# EAGLE design ultrasonic v1 (EAGLE 7.6.0)
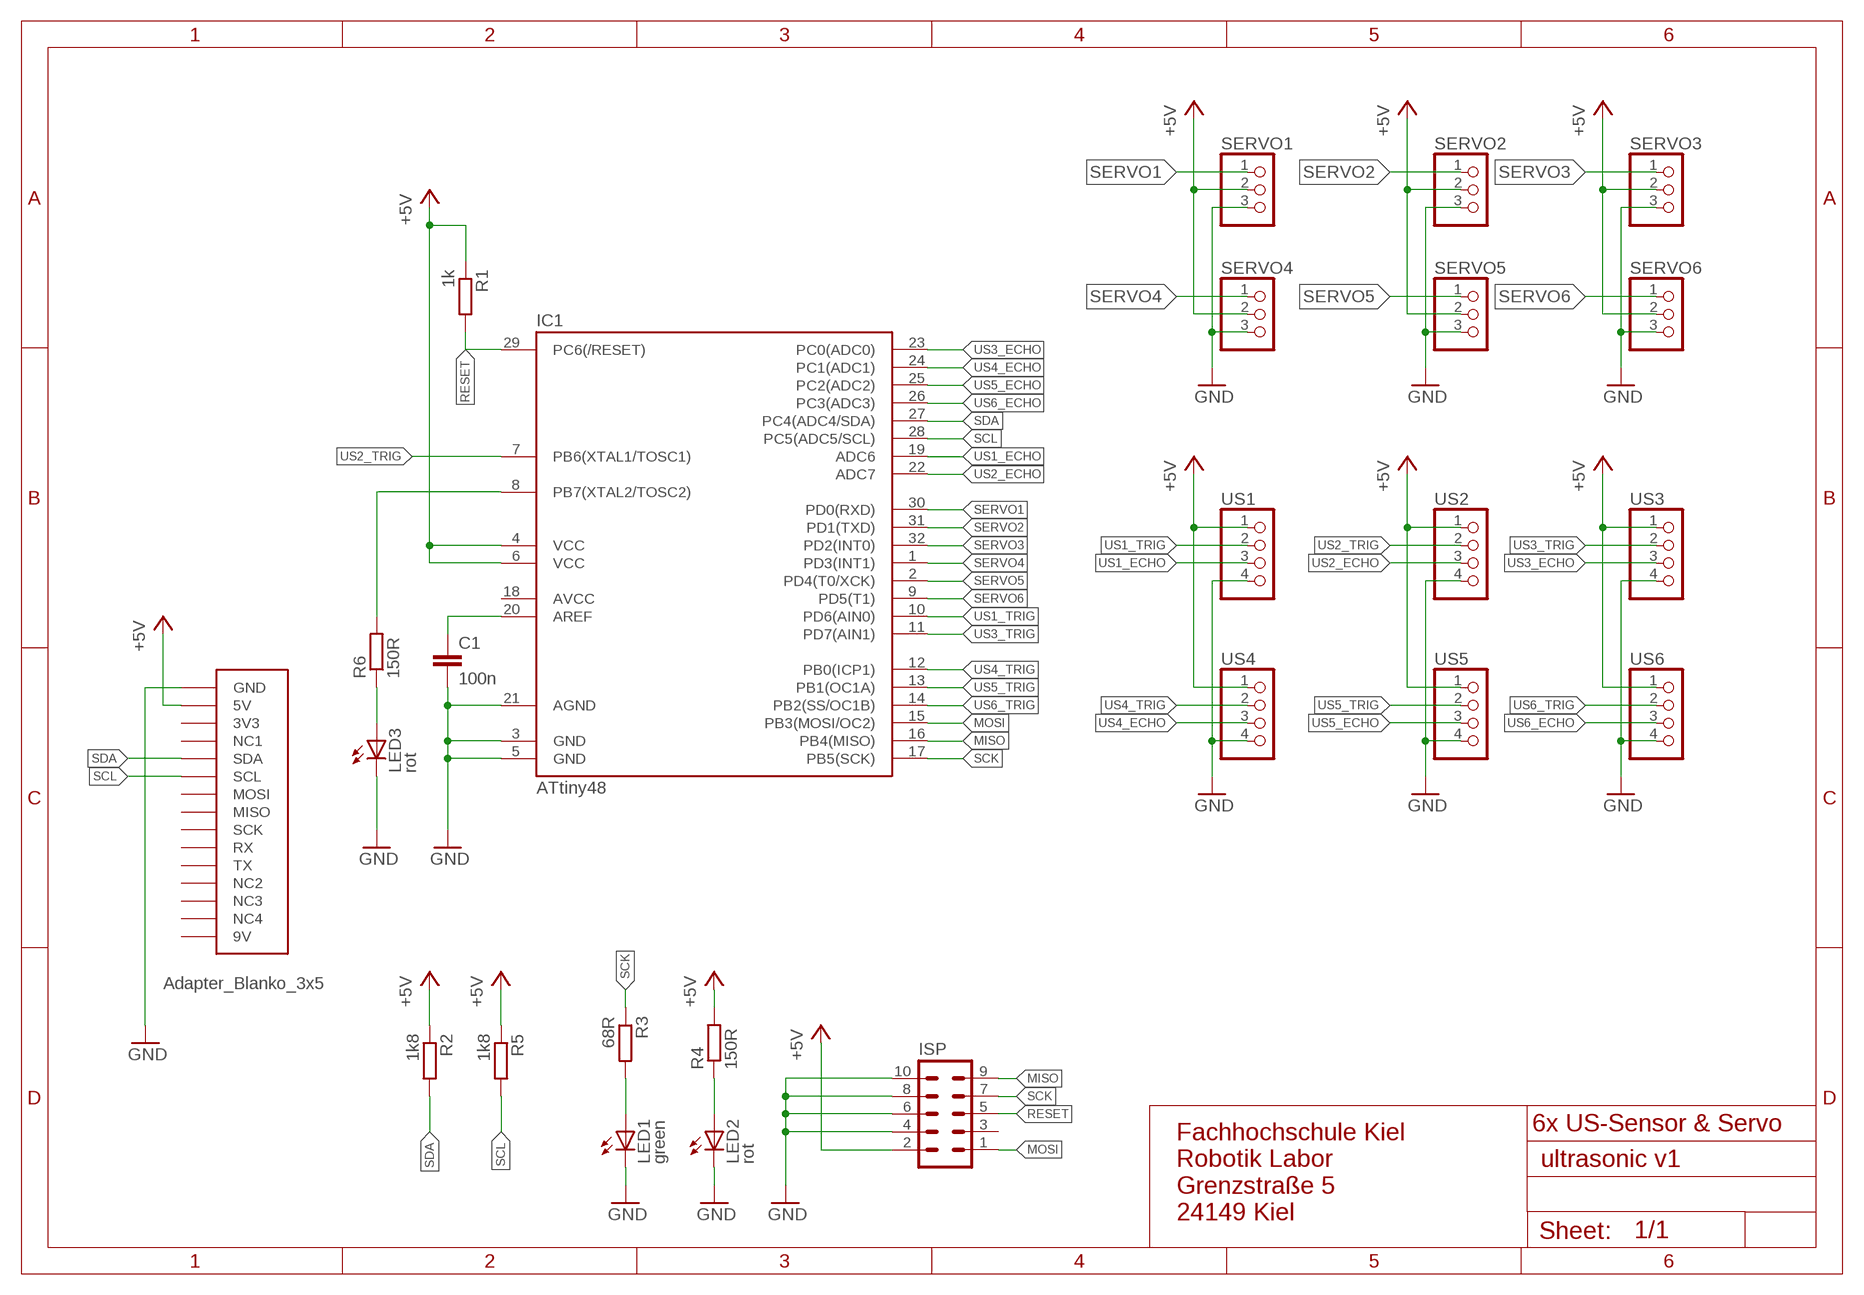
[diagram p0: schematic, sheet 1]

## Parts
C1  100n  C-EUC0805  [C0805]
IC1  ATtiny48  ATMEGA8-AU  [TQFP32-08]
ISP  ML10L  [ML10L]
LED1  green  LEDCHIP-LED0805  [CHIP-LED0805]
LED2  rot  LEDCHIP-LED0805  [CHIP-LED0805]
LED3  rot  LEDCHIP-LED0805  [CHIP-LED0805]
R1  1k  R-EU_R0805W  [R0805W]
R2  1k8  R-EU_R0805W  [R0805W]
R3  68R  R-EU_R0805W  [R0805W]
R4  150R  R-EU_R0805W  [R0805W]
R5  1k8  R-EU_R0805W  [R0805W]
R6  150R  R-EU_R0805W  [R0805W]
SERVO1  PINHD-1X3  [1X03]
SERVO2  PINHD-1X3  [1X03]
SERVO3  PINHD-1X3  [1X03]
SERVO4  PINHD-1X3  [1X03]
SERVO5  PINHD-1X3  [1X03]
SERVO6  PINHD-1X3  [1X03]
U$1  ADAPTER_BLANKO_3X5B2  [ADAPTER_BLANKO_3X5_B2]
US1  PINHD-1X4  [1X04]
US2  PINHD-1X4  [1X04]
US3  PINHD-1X4  [1X04]
US4  PINHD-1X4  [1X04]
US5  PINHD-1X4  [1X04]
US6  PINHD-1X4  [1X04]

## Nets
+5V: IC1.4(VCC) IC1.6(VCC) ISP.2 R1.1 R2.1 R4.2 R5.1 SERVO1.2 SERVO2.2 SERVO3.2 SERVO4.2 SERVO5.2 SERVO6.2 U$1.5V U$1.5V_1(5V) US1.1 US2.1 US3.1 US4.1 US5.1 US6.1
GND: C1.2 IC1.3(GND) IC1.5(GND) IC1.21(AGND) ISP.4 ISP.6 ISP.8 ISP.10 LED1.C LED2.C LED3.C SERVO1.3 SERVO2.3 SERVO3.3 SERVO4.3 SERVO5.3 SERVO6.3 U$1.GND U$1.GND1(GND) U$1.GND2(GND) U$1.GND3(GND) US1.4 US2.4 US3.4 US4.4 US5.4 US6.4
MISO: IC1.16(PB4(MISO)) ISP.9
MOSI: IC1.15(PB3(MOSI/OC2)) ISP.1
N$1: IC1.8(PB7(XTAL2/TOSC2)) R6.2
N$2: LED3.A R6.1
N$6: LED1.A R3.2
N$7: LED2.A R4.1
N$9: C1.1 IC1.20(AREF)
RESET: IC1.29(PC6(/RESET)) ISP.5 R1.2
SCK: IC1.17(PB5(SCK)) ISP.7 R3.1
SCL: IC1.28(PC5(ADC5/SCL)) R5.2 U$1.SCL U$1.SCL_1(SCL)
SDA: IC1.27(PC4(ADC4/SDA)) R2.2 U$1.SDA U$1.SDA_1(SDA)
SERVO1: IC1.30(PD0(RXD)) SERVO1.1
SERVO2: IC1.31(PD1(TXD)) SERVO2.1
SERVO3: IC1.32(PD2(INT0)) SERVO3.1
SERVO4: IC1.1(PD3(INT1)) SERVO4.1
SERVO5: IC1.2(PD4(T0/XCK)) SERVO5.1
SERVO6: IC1.9(PD5(T1)) SERVO6.1
US1_ECHO: IC1.19(ADC6) US1.3
US1_TRIG: IC1.10(PD6(AIN0)) US1.2
US2_ECHO: IC1.22(ADC7) US2.3
US2_TRIG: IC1.7(PB6(XTAL1/TOSC1)) US2.2
US3_ECHO: IC1.23(PC0(ADC0)) US3.3
US3_TRIG: IC1.11(PD7(AIN1)) US3.2
US4_ECHO: IC1.24(PC1(ADC1)) US4.3
US4_TRIG: IC1.12(PB0(ICP1)) US4.2
US5_ECHO: IC1.25(PC2(ADC2)) US5.3
US5_TRIG: IC1.13(PB1(OC1A)) US5.2
US6_ECHO: IC1.26(PC3(ADC3)) US6.3
US6_TRIG: IC1.14(PB2(SS/OC1B)) US6.2
Unconnected: IC1.18(AVCC) ISP.3 U$1.3V3 U$1.3V3_1(3V3) U$1.9V U$1.9V_1(9V) U$1.MISO U$1.MISO_1(MISO) U$1.MOSI U$1.MOSI_1(MOSI) U$1.NC1 U$1.NC2 U$1.NC3 U$1.NC4 U$1.NC5(NC1) U$1.NC6(NC2) U$1.NC7(NC3) U$1.NC8(NC4) U$1.RX U$1.RX_1(RX) U$1.SCK U$1.SCK_1(SCK) U$1.TX U$1.TX_1(TX)

## Notes on the sheet
- 6x US-Sensor & Servo
- Fachhochschule Kiel
  Robotik Labor
  Grenzstraße 5
  24149 Kiel

## Library data of the parts
C1 = rcl:C-EU: CAPACITOR, European symbol
IC1 = atmega8:ATMEGA8
ISP = con-ml:ML10L: HARTING; OC_FARNELL: unknown; OC_NEWARK: unknown
LED1-LED3 = led:LED: LED OSRAM: - CHIPLED LG R971, LG N971, LY N971, LG Q971, LY Q971, LO R971, LY R971 LH N974, LH R974 LS Q976, LO Q976, LY Q976 LO Q996 - Hyper CHIPLED LW Q18S LB Q993, LB Q99A, LB R99A - SideLED LS A670, LO A670, LY A670, LG A670, LP A670 LB A673, LV A673, LT A673, LW A673 LH A674 LY A675 LS A676, LA A676, LO A676, LY A676, LW A676 LS A679, LY A679, LG A679 - Hyper Micro SIDELED® LS Y876, LA Y876, LO Y876, LY Y876 LT Y87S - SmartLED LW L88C, LW L88S LB L89C, LB L89S, LG L890 LS L89K, LO L89K, LY L89K LS L896, LA L896, LO L896, LY L896 - TOPLED LS T670, LO T670, LY T670, LG T670, LP T670 LSG T670, LSP T670, LSY T670, LOP T670, LYG T670 LG T671, LOG T671, LSG T671 LB T673, LV T673, LT T673, LW T673 LH T674 LS T676, LA T676, LO T676, LY T676, LB T676, LH T676, LSB T676, LW T676 LB T67C, LV T67C, LT T67C, LS T67K, LO T67K, LY T67K, LW E67C LS E67B, LA E67B, LO E67B, LY E67B, LB E67C, LV E67C, LT E67C LW T67C LS T679, LY T679, LG T679 LS T770, LO T770, LY T770, LG T770, LP T770 LB T773, LV T773, LT T773, LW T773 LH T774 LS E675, LA E675, LY E675, LS T675 LS T776, LA T776, LO T776, LY T776, LB T776 LHGB T686 LT T68C, LB T68C - Hyper Mini TOPLED® LB M676 - Mini TOPLED Santana® LG M470 LS M47K, LO M47K, LY M47K Source: http://www.osram.convergy.de LUXEON: - LUMILED® LXK2-PW12-R00, LXK2-PW12-S00, LXK2-PW14-U00, LXK2-PW14-V00 LXK2-PM12-R00, LXK2-PM12-S00, LXK2-PM14-U00 LXK2-PE12-Q00, LXK2-PE12-R00, LXK2-PE12-S00, LXK2-PE14-T00, LXK2-PE14-U00 LXK2-PB12-K00, LXK2-PB12-L00, LXK2-PB12-M00, LXK2-PB14-N00, LXK2-PB14-P00, LXK2-PB14-Q00 LXK2-PR12-L00, LXK2-PR12-M00, LXK2-PR14-Q00, LXK2-PR14-R00 LXK2-PD12-Q00, LXK2-PD12-R00, LXK2-PD12-S00 LXK2-PH12-R00, LXK2-PH12-S00 LXK2-PL12-P00, LXK2-PL12-Q00, LXK2-PL12-R00 Source: www.luxeon.com KINGBRIGHT: KA-3528ASYC Source: www.kingbright.com
R1-R6 = rcl:R-EU_: RESISTOR, European symbol
SERVO1-SERVO6 = pinhead:PINHD-1X3: PIN HEADER
U$1 = Tim:ADAPTER_BLANKO_3X5: B1 = Beschriftung innen B2 = Beschriftung aussen
US1-US6 = pinhead:PINHD-1X4: PIN HEADER

## Board
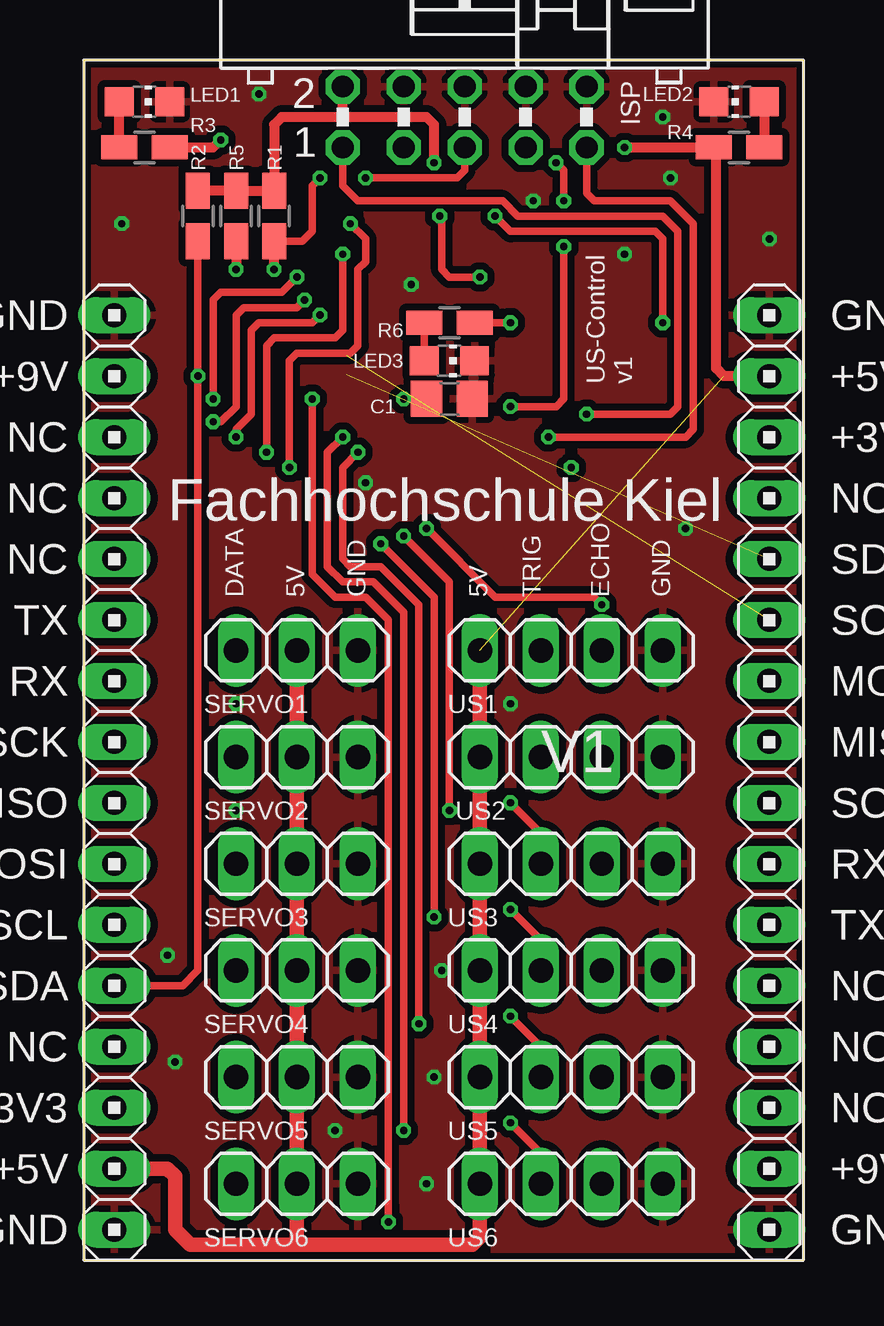
[diagram p1: board, top side]
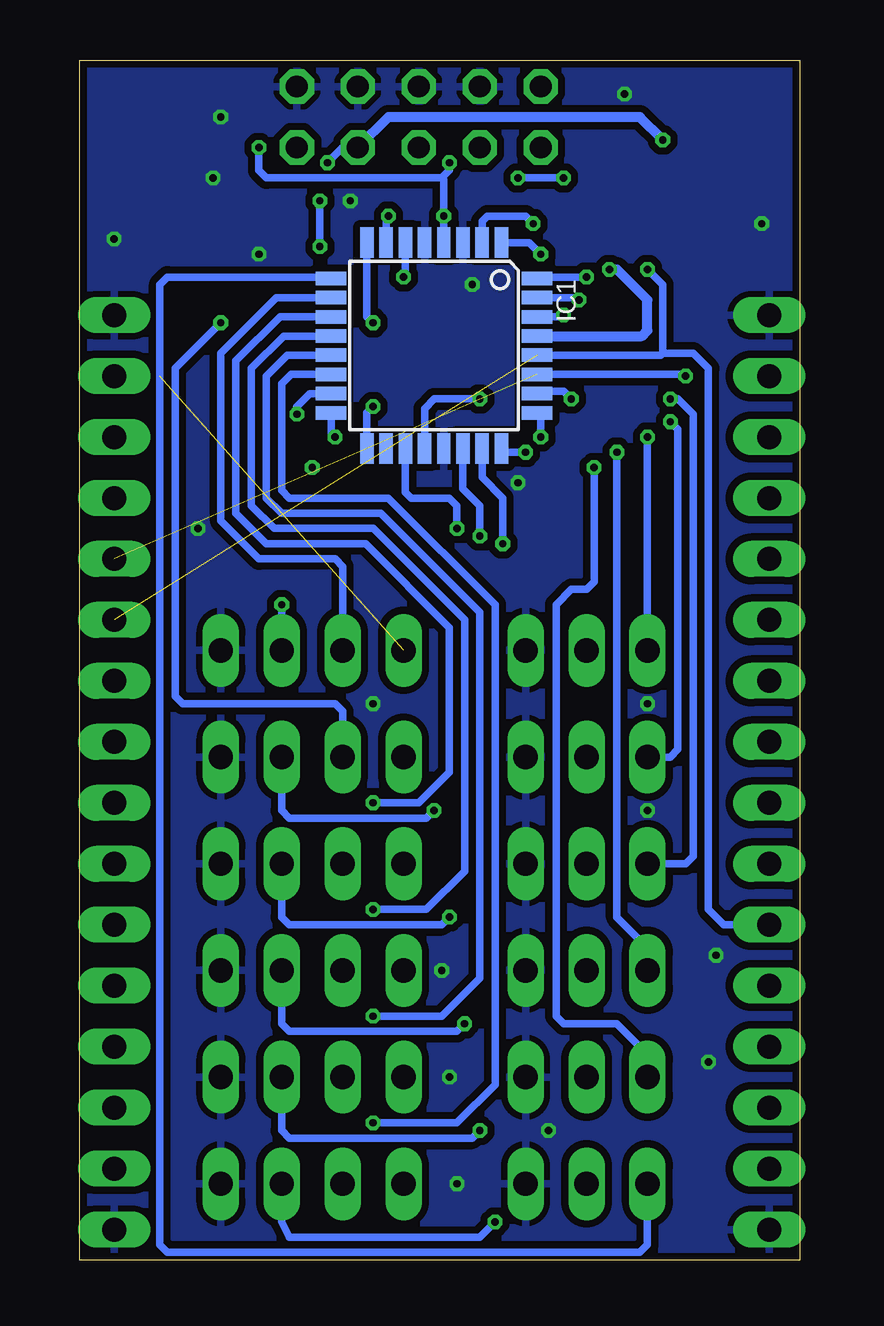
[diagram p2: board, bottom side, seen from below]

Size 30 x 50 mm. Coordinates in mm from the lower left corner, seen from the top.
Outline: 0,0 30,0 30,50 0,50 0,0
Copper layers (1*16): Top 0.035mm / dielectric 1.5mm / Bottom 0.035mm
Design rules "dirt_cheap_dirty_boards.v1": minimum track width 5mil, minimum drill 12mil, track to track 5mil, track to pad 5mil, pad to pad 5mil, via to via 5mil, smd to smd 0mil, copper to edge 10mil, drill to drill 10mil, minimum pad ring 10mil, minimum via ring 6mil, stop-mask expansion 2mil, vias tented up to drill 25mil, thermal gap 10mil

### Footprints (pad centres in the part's own frame; a part is rotated, then mirrored left to right if it is on the bottom)
C0805 = smd 1.3 x 1.5: 1 -0.95,0; 2 0.95,0
TQFP32-08 = smd 1.27 x 0.559: 1 -4.293,2.8; 2 -4.293,2; 3 -4.293,1.2; 4 -4.293,0.4; 5 -4.293,-0.4; 6 -4.293,-1.2; 7 -4.293,-2; 8 -4.293,-2.8; 17 4.293,-2.8; 18 4.293,-2; 19 4.293,-1.2; 20 4.293,-0.4; 21 4.293,0.4; 22 4.293,1.2; 23 4.293,2; 24 4.293,2.8 | smd 0.559 x 1.27: 9 -2.8,-4.293; 10 -2,-4.293; 11 -1.2,-4.293; 12 -0.4,-4.293; 13 0.4,-4.293; 14 1.2,-4.293; 15 2,-4.293; 16 2.8,-4.293; 25 2.8,4.293; 26 2,4.293; 27 1.2,4.293; 28 0.4,4.293; 29 -0.4,4.293; 30 -1.2,4.293; 31 -2,4.293; 32 -2.8,4.293
ML10L = drill 0.914 octagon: 1 -5.08,-1.27; 2 -5.08,1.27; 3 -2.54,-1.27; 4 -2.54,1.27; 5 0,-1.27; 6 0,1.27; 7 2.54,-1.27; 8 2.54,1.27; 9 5.08,-1.27; 10 5.08,1.27
CHIP-LED0805 = smd 1.2 x 1.2: A 0,-1.05; C 0,1.05
R0805W = smd 1.5 x 1: 1 -1.052,0; 2 1.052,0
1X03 = drill 1.016 long: 1 -2.54,0; 2 0,0; 3 2.54,0
ADAPTER_BLANKO_3X5_B2 = drill 1 long: 3V3 1.278,6.349; 3V3_1 28.566,34.289; 5V 1.278,3.809; 5V_1 28.566,36.829; 9V 1.278,36.829; 9V_1 28.566,3.809; GND 1.278,1.269; GND1 1.278,39.369; GND2 28.566,39.369; GND3 28.566,1.269; MISO 1.278,19.049; MISO_1 28.566,21.589; MOSI 1.278,16.509; MOSI_1 28.566,24.129; NC1 1.278,8.889; NC2 1.278,29.209; NC3 1.278,31.749; NC4 1.278,34.289; NC5 28.566,31.749; NC6 28.566,11.429; NC7 28.566,8.889; NC8 28.566,6.349; RX 1.278,24.129; RX_1 28.566,16.509; SCK 1.278,21.589; SCK_1 28.566,19.049; SCL 1.278,13.969; SCL_1 28.566,26.669; SDA 1.278,11.429; SDA_1 28.566,29.209; TX 1.278,26.669; TX_1 28.566,13.969
1X04 = drill 1.016 long: 1 -3.81,0; 2 -1.27,0; 3 1.27,0; 4 3.81,0

### Placement (x,y rotation side)
C1  15.24,35.88 0 top
IC1  15.24,38.1 270 bottom
ISP  15.88,47.62 0 top
LED1  2.54,48.26 270 top
LED2  27.3,48.26 90 top
LED3  15.24,37.47 270 top
R1  7.94,43.5 270 top
R2  4.76,43.5 270 top
R3  2.54,46.35 180 top
R4  27.3,46.35 180 top
R5  6.35,43.5 270 top
R6  15.24,39.05 0 top
SERVO1  8.89,25.4 0 top
SERVO2  8.89,20.95 0 top
SERVO3  8.89,16.51 0 top
SERVO4  8.89,12.06 0 top
SERVO5  8.89,7.62 0 top
SERVO6  8.89,3.17 0 top
U$1  0,0 0 top
US1  20.32,25.4 0 top
US2  20.32,20.95 0 top
US3  20.32,16.51 0 top
US4  20.32,12.06 0 top
US5  20.32,7.62 0 top
US6  20.32,3.17 0 top

### Tracks (layer width: path | path; a pad name or v marks a point on that pad's centre or on a via)
+5V  (via drill 0.3)  (1 unrouted)
  Top 0.305: v16.51,40.96 15.24,40.96 14.92,41.27 14.92,43.41 v14.84,43.5
  Top 0.406: v22.54,46.35 R4.2 26.35,46.26 26.35,37.15 26.67,36.83 U$1.5V_1 | R2.1 R5.1 R1.1 7.94,47.31 8.26,47.62 10.79,47.62 | v14.61,45.72 14.61,47.31 14.29,47.62 10.79,47.62 | 10.79,47.62 ISP.2 | 3.49,3.81
  Top 0.61: SERVO1.2 SERVO2.2 SERVO3.2 SERVO4.2 SERVO5.2 SERVO6.2 8.89,0.64 | US1.1 US2.1 US3.1 US4.1 US5.1 US6.1 16.51,0.95 16.19,0.64 8.89,0.64 | 3.49,3.81 3.81,3.49 3.81,1.27 4.45,0.64 8.89,0.64 | U$1.5V 3.49,3.81
  Bottom 0.305: v22.54,46.35 22.54,45.4 22.23,45.09 14.92,45.09 | v14.61,45.72 14.61,45.4 14.92,45.09 | 14.92,45.09 14.84,45 v14.84,43.5 IC1.4 | IC1.6 16.44,41.03 v16.51,40.96
GND  (via drill 0.3)
  other vias: 1.59,43.18 7.3,48.58 24.13,47.62 28.57,42.55 13.65,40.64 18.73,44.13 22.54,41.91 24.45,45.09 3.49,12.7 3.81,8.26 14.29,3.17 14.92,12.06 14.61,7.62 10.48,5.4 6.35,23.18 6.35,18.73 11.75,32.38 25.08,30.48 17.78,23.18
  pour Bottom (isolate 0.305): 0,0 0,49.85 30.16,49.85 30.16,0
  pour Top (isolate 0.305): 0,0 0,49.85 30.16,49.85 30.16,0
MISO  (via drill 0.3)
  Top 0.305: v19.37,34.29 25.08,34.29 25.4,34.61 25.4,43.18 24.45,44.13 21.27,44.13 20.95,44.45 ISP.9
  Bottom 0.305: IC1.16 19.53,34.45 v19.37,34.29
MOSI  (via drill 0.3)
  Top 0.305: ISP.1 10.79,44.77 11.43,44.13 17.46,44.13 18.1,43.5 24.13,43.5 24.77,42.86 24.77,35.56 24.45,35.24 v20.95,35.24
  Bottom 0.305: IC1.15 20.41,36.1 20.95,35.56 v20.95,35.24
N$1  (via drill 0.3)
  Top 0.305: v17.78,39.05 R6.2
  Bottom 0.305: IC1.8 18.04,39.31 v17.78,39.05
N$2
  Top 0.305: R6.1 LED3.A
N$6
  Top 0.406: R3.2 LED1.A
N$7
  Top 0.406: LED2.A R4.1
N$9  (via drill 0.3)
  Top 0.305: v13.34,35.88 C1.1
  Bottom 0.305: IC1.20 15.64,35.48 15.24,35.88 v13.34,35.88
N$11  (via drill 0.3)
  other vias: 20.32,33.02
RESET  (via drill 0.3)
  Top 0.305: ISP.5 15.88,45.4 15.56,45.09 v11.75,45.09 | v9.84,45.09 9.53,44.77 9.53,42.86 9.11,42.45 R1.2
  Top 0.406: v7.94,41.27 R1.2
  Bottom 0.305: v11.75,45.09 v9.84,45.09
  Bottom 0.406: IC1.29 6.58,38.5 6.35,38.73 6.35,40.01 7.62,41.27 v7.94,41.27
SCK  (via drill 0.3)
  Top 0.305: v20,44.13 20,45.4 v19.68,45.72 | v17.78,35.56 19.68,35.56 20,35.88 v20,42.23
  Top 0.406: R3.1 5.4,46.35 v5.71,46.67
  Bottom 0.305: v20,42.23 v20,44.13 | v19.68,45.72 19.05,46.35 ISP.7 | IC1.17 18.04,35.3 v17.78,35.56
  Bottom 0.406: ISP.7 17.14,47.62 6.67,47.62 v5.71,46.67
SCL  (via drill 0.3)  (1 unrouted)
  Top 0.406: R5.2 v6.35,41.27
  Bottom 0.305: 6.03,40.96 v6.35,41.27 5.71,40.64 5.71,37.78 | 5.71,37.78 4.45,37.78 3.81,37.15 3.81,14.61 3.17,13.97 U$1.SCL | IC1.28 5.8,37.7 5.71,37.78
SDA  (via drill 0.3)  (1 unrouted)
  Top 0.305: 4.51,42.2 R2.2 v4.76,36.83 4.76,12.06 4.13,11.43 U$1.SDA
  Bottom 0.305: IC1.27 4.83,36.9 v4.76,36.83
SERVO1  (via drill 0.3)
  Top 0.305: v6.35,34.29 6.35,34.61 6.99,35.24 6.99,38.73 7.3,39.05 9.53,39.05 v9.84,39.37
  Bottom 0.305: SERVO1.1 v6.35,34.29 | IC1.30 9.91,39.3 v9.84,39.37
SERVO2  (via drill 0.3)
  Top 0.305: v5.4,34.92 5.71,34.92 6.35,35.56 6.35,39.37 6.67,39.69 8.89,39.69 v9.21,40.01
  Bottom 0.305: SERVO2.1 5.4,20.95 5.08,21.27 5.08,34.61 v5.4,34.92 | IC1.31 9.3,40.1 v9.21,40.01
SERVO3  (via drill 0.3)
  Top 0.305: v5.4,35.88 5.4,40.01 5.71,40.32 8.26,40.32 v8.89,40.96
  Bottom 0.305: SERVO3.1 4.76,16.51 4.45,16.83 4.45,35.24 5.08,35.88 v5.4,35.88 | v8.89,40.96 10.89,40.96 IC1.32
SERVO4  (via drill 0.3)
  Top 0.305: v7.62,33.66 7.62,38.1 7.94,38.42 10.48,38.42 10.79,38.73 v10.79,41.91
  Bottom 0.305: SERVO4.1 6.35,13.02 7.62,14.29 v7.62,33.66 | 11.11,42.23 v10.79,41.91 11.28,42.39 IC1.1
SERVO5  (via drill 0.3)
  Top 0.305: v8.57,33.02 8.57,37.47 8.89,37.78 11.11,37.78 11.43,38.1 11.43,41.27 11.75,41.59 11.75,42.55 v11.11,43.18
  Bottom 0.305: SERVO5.1 6.35,8.57 7.62,9.84 9.84,9.84 10.16,10.16 10.16,27.3 9.53,27.94 8.89,27.94 8.57,28.26 v8.57,33.02 | v11.11,43.18 11.43,43.5 13.02,43.5 13.24,43.27 IC1.2
SERVO6
  Bottom 0.305: SERVO6.1 6.35,0.64 6.67,0.32 26.35,0.32 26.67,0.64 26.67,40.64 26.35,40.96 19.59,40.96 IC1.9
US1_ECHO  (via drill 0.3)
  Top 0.305: v21.59,27.3 21.27,27.62 17.14,27.62 v14.29,30.48
  Bottom 0.305: US1.3 v21.59,27.3 | v14.29,30.48 14.29,31.43 14.61,31.75 16.19,31.75 16.44,32 IC1.19
US1_TRIG
  Bottom 0.305: US1.2 19.05,28.89 19.37,29.21 22.54,29.21 24.13,30.8 24.13,37.78 21.81,40.1 IC1.10
US2_ECHO  (via drill 0.3)
  Top 0.305: v15.24,18.73 15.24,28.26 v13.34,30.16
  Bottom 0.305: US2.3 21.59,18.73 21.27,18.41 15.56,18.41 v15.24,18.73 | v13.34,30.16 13.34,31.43 14.04,32.14 IC1.22
US2_TRIG  (via drill 0.3)
  Top 0.305: v24.13,39.05 24.13,42.55 23.81,42.86 17.78,42.86 v17.14,43.5
  Bottom 0.305: US2.2 19.05,22.86 19.37,23.18 25.72,23.18 26.04,23.5 26.04,37.15 v24.13,39.05 | IC1.7 17.24,43.4 v17.14,43.5
US3_ECHO  (via drill 0.3)
  Top 0.305: v14.61,14.29 14.61,27.62 v12.38,29.84
  Bottom 0.305: US3.3 21.59,14.29 21.27,13.97 14.92,13.97 v14.61,14.29 | v12.38,29.84 12.38,31.75 13.24,32.61 IC1.23
US3_TRIG  (via drill 0.3)
  Top 0.305: US3.2 19.05,17.78 v17.78,19.05
  Bottom 0.305: v17.78,19.05 15.88,19.05 14.61,20.32 14.61,26.35 18.1,29.84 22.23,29.84 23.5,31.11 23.5,37.47 21.66,39.3 IC1.11
US4_ECHO  (via drill 0.3)
  Top 0.305: v13.97,9.84 13.97,27.3 12.38,28.89 11.11,28.89 10.79,29.21 10.79,33.02 v11.43,33.66
  Bottom 0.305: US4.3 21.59,9.84 21.27,9.53 14.29,9.53 v13.97,9.84 | v11.43,33.66 12.29,33.66 IC1.24
US4_TRIG  (via drill 0.3)
  Top 0.305: US4.2 19.05,13.34 v17.78,14.61
  Bottom 0.305: v17.78,14.61 15.56,14.61 13.97,16.19 13.97,26.67 17.78,30.48 21.91,30.48 22.86,31.43 22.86,37.15 21.51,38.5 IC1.12
US5_ECHO  (via drill 0.3)
  Top 0.305: v13.34,5.4 13.34,26.99 12.06,28.26 10.79,28.26 10.16,28.89 10.16,33.66 v10.79,34.29
  Bottom 0.305: US5.3 21.59,5.4 21.27,5.08 13.65,5.08 v13.34,5.4 | v10.79,34.29 10.79,35.15 IC1.25
US5_TRIG  (via drill 0.3)
  Top 0.305: US5.2 19.05,8.89 v17.78,10.16
  Bottom 0.305: v17.78,10.16 14.92,10.16 13.34,11.75 13.34,26.99 17.46,31.11 21.59,31.11 22.23,31.75 22.23,36.83 21.36,37.7 IC1.13
US6_ECHO  (via drill 0.3)
  Top 0.305: v9.53,35.88 9.53,28.57 10.48,27.62 11.75,27.62 12.7,26.67 12.7,2.22 v12.7,1.59
  Bottom 0.305: US6.3 21.59,1.59 21.27,0.95 13.34,0.95 v12.7,1.59 | IC1.26 10.85,36.2 9.84,36.2 v9.53,35.88
US6_TRIG  (via drill 0.3)
  Top 0.305: US6.2 19.05,4.45 v17.78,5.71
  Bottom 0.305: v17.78,5.71 14.29,5.71 12.7,7.3 12.7,27.3 17.14,31.75 21.27,31.75 21.59,32.07 21.59,36.51 21.2,36.9 IC1.14

### Text on the board
tNames: US-Control / v1 | Fachhochschule Kiel | DATA | 5V | GND | 5V | TRIG | ECHO | GND | V1